# EAGLE schematic komparator-cascade (EAGLE 6.6.0)
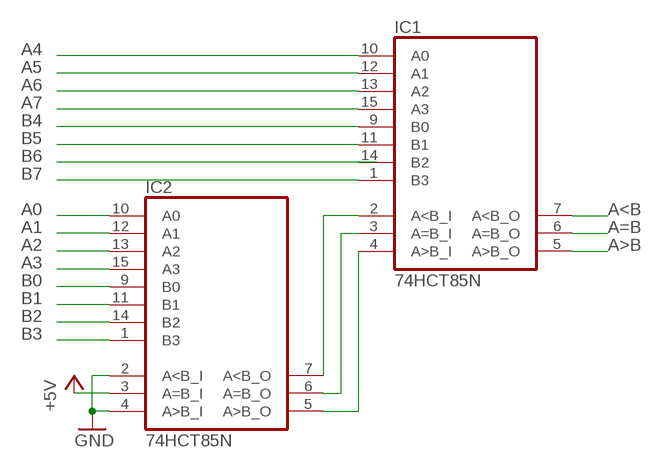
[diagram p0: schematic, sheet 1]

## Parts
IC1  74HCT85N  [DIL16]
IC2  74HCT85N  [DIL16]

## Nets
+5V: IC2.3(A=B_I)
A0: IC2.10(A0)
A1: IC2.12(A1)
A2: IC2.13(A2)
A3: IC2.15(A3)
A4: IC1.10(A0)
A5: IC1.12(A1)
A6: IC1.13(A2)
A7: IC1.15(A3)
A<B: IC1.7(A<B_O)
A=B: IC1.6(A=B_O)
A>B: IC1.5(A>B_O)
B0: IC2.9(B0)
B1: IC2.11(B1)
B2: IC2.14(B2)
B3: IC2.1(B3)
B4: IC1.9(B0)
B5: IC1.11(B1)
B7: IC1.1(B3)
GND: IC2.2(A<B_I) IC2.4(A>B_I)
N$1: IC1.2(A<B_I) IC2.7(A<B_O)
N$2: IC1.3(A=B_I) IC2.6(A=B_O)
N$3: IC1.4(A>B_I) IC2.5(A>B_O)
Unconnected: IC1.14(B2)

## Power pins joined to a net without a drawn wire
GND: IC1.8(GND) IC2.8(GND)
VCC: IC1.16(VCC) IC2.16(VCC)

## Library data of the parts
IC1 IC2 = 74xx-eu:74*85: 4-bit magnitude COMPARATOR